# Altium schematic sheet Sheetlaba1.SchDoc
size A4
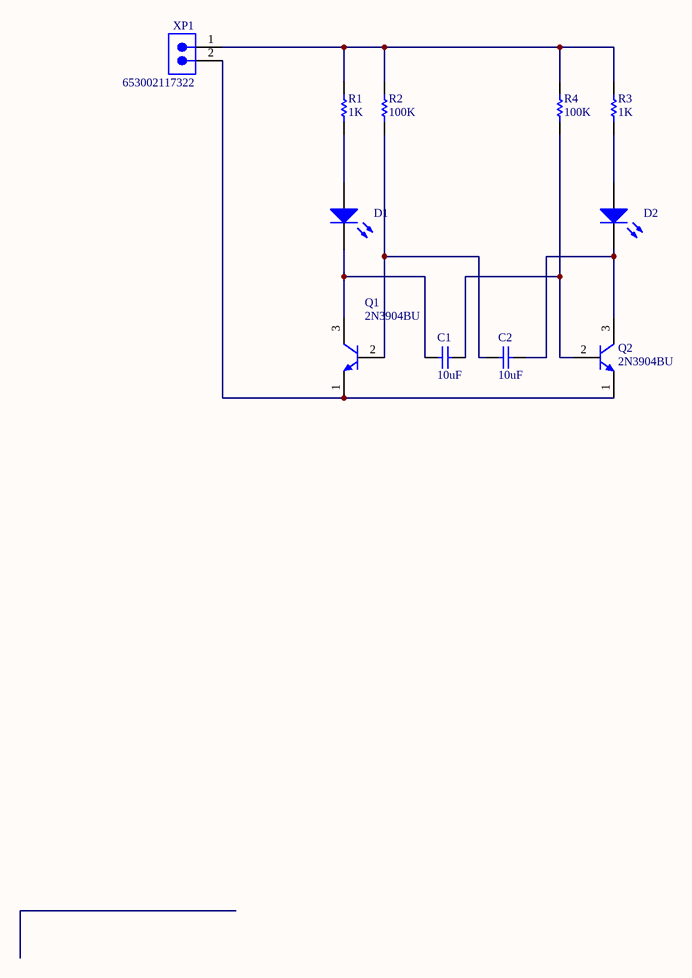
[diagram p0: Sheetlaba1.SchDoc]

## Parts
C1  value 10uF  (hidden comment: Capacitor)
C2  value 10uF  (hidden comment: Capacitor)
D1  Light-Emitting Diode  (value not drawn)
D2  Light-Emitting Diode  (value not drawn)
Q1  2N3904BU  [FAIR-TO-92]
Q2  2N3904BU  [FAIR-TO-92]
R1  value 1K  (hidden comment: Resistor)
R2  value 100K  (hidden comment: Resistor)
R3  value 1K  (hidden comment: Resistor)
R4  value 100K  (hidden comment: Resistor)
XP1  653002117322  [653002117322]

## Nets
NetC1_1: C1.1 Q2.2(B) R4.1
NetC1_2: C1.2 D1.2(K) Q1.3(C)
NetC2_1: C2.1 D2.2(K) Q2.3(C)
NetC2_2: C2.2 Q1.2(B) R2.2
NetD1_1: D1.1(A) R1.2
NetD2_1: D2.1(A) R3.1
NetQ1_1: Q1.1(E) Q2.1(E) XP1.2
NetR1_1: R1.1 R2.1 R3.2 R4.2 XP1.1

## Library data of the parts
C1 C2 = Capacitor: SimulationGenericComponent: True
D1 D2 = LED: AF: 1; BV: 0; BV_MAX: 1e99; EG: 1.11; FC: 0.5; IBV: 0.001; IS: 1e-14; MJSW: 0.33; NTUN: 30; TNOM: 27; XTI: 3; SimulationGenericComponent: True; CJO: 0; CJP: 0; CTA: 0; CTP: 0; FCS: 0.5; FV_MAX: 1e99; IKF: 0; IKR: 0; ISR: 1e-14; JSW: 0; JTUN: 0; JTUNSW: 0; KEG: 1; KF: 0; LEVEL: 1; N: 1; NBV: 1; NR: 1; NS: 1; PHP: 1; RS: 0; TCV: 0; TLEV: 0; TLEVC: 0; TM1: 0; TM2: 0; TPB: 0; TPHP: 0; TRS: 0; TRS2: 0; TT: 0; TTT1: 0; TTT2: 0; VJ: 1; XTITUN: 3
Q1 Q2 = CMP-2000-04944-1: NPN General-Purpose Amplifier, 40 V VCEO, 0.2 A, -55 to 150 degC, 2-Pin TO-92, RoHS, Bulk; Manufacturer: FairchildSemiconductor; Maximum Collector Base Voltage: 60V; Minimum DC Current Gain: 40@0.1mA@1V; Maximum Collector Emitter Voltage: 40V; Maximum DC Collector Current: 0.2A; Rad Hard: No; Maximum Operating Frequency: 300(Min)MHz; Maximum Collector Emitter Saturation Voltage: 0.2@1mA@10mA; Maximum Power Dissipation: 625mW; Package Description: 3-Pin Transistor Outline Package, Body Dia 4.79 mm, Pitch 1.27 mm; Package Reference: TO-92; Pin Count: 3; Operating Temperature: -55to150degC; Category: GPBJT; Manufacturer URL: https://www.fairchildsemi.com/; Datasheet URL: https://datasheet.ciiva.com/4722/2n3904-82270-4722369.pdf; Package: 3TO-92; Packaging: Bulk; Type: NPN; Datasheet Version: Rev. 1.1.0, 10/2014; Mounting: ThroughHole
R1-R4 = Resistor: TC1: 0; SimulationGenericComponent: True; TC2: 0
XP1 = CMP-1502-00748-3: Conn, R/A Header, 2Pos, 1Row, 1.25Mm Rohs Compliant: Yes; Gender: Male; Current Rating: 1A; Insulation Resistance: 100MΩ; Number of Pins: 2; RoHS: Compliant; Contact Plating: Tin; Length: 4.25mm; Min Operating Temperature: -40°C; Max Operating Temperature: 85°C; Pitch: 1.25mm